# EAGLE schematic camera_and_stage (EAGLE 6.1)
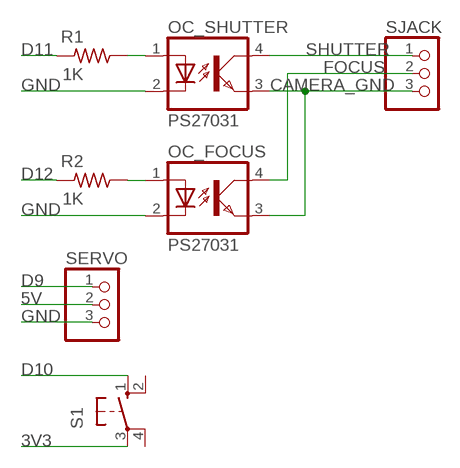
[diagram p0: schematic, sheet 1]

## Parts
OC_FOCUS  PS27031  [SMD4]
OC_SHUTTER  PS27031  [SMD4]
R1  1K  R-US_0204/7  [0204/7]
R2  1K  R-US_0204/7  [0204/7]
S1  10-XX  [B3F-10XX]
SERVO  PINHD-1X3  [1X03]
SJACK  PINHD-1X3  [1X03]

## Nets
3V3: S1.3(P)
5V [power]: SERVO.2
CAMERA_GND: OC_FOCUS.3(EMIT) OC_SHUTTER.3(EMIT) SJACK.3
D9: SERVO.1
D10: S1.1(S)
D11: R1.2
D12: R2.2
FOCUS: OC_FOCUS.4(COL) SJACK.2
GND [power]: OC_FOCUS.2(C) OC_SHUTTER.2(C) SERVO.3
N$2: OC_FOCUS.1(A) R2.1
R1: OC_SHUTTER.1(A) R1.1
SHUTTER: OC_SHUTTER.4(COL) SJACK.1
Unconnected: S1.2(S1) S1.4(P1)

## Library data of the parts
OC_FOCUS OC_SHUTTER = PS2703:PS2703: OPTO COUPLER Source: LITEON, LTV816.pdf; OC_FARNELL: unknown; OC_NEWARK: unknown
R1 R2 = rcl:R-US_: RESISTOR, American symbol
S1 = TACT:10-XX: OMRON SWITCH; MPN: B3F-1000; OC_FARNELL: 176432; OC_NEWARK: 36M3542
SERVO SJACK = pinhead:PINHD-1X3: PIN HEADER

## Net classes
1 power: width 0.406 mm, drill 0.406 mm